# Altium schematic sheet RES-001 AutoHAT V2 SD Adapter Sub-Board - Top.SchDoc: Top
size A3; CheckedBy: K Riegel; DrawnBy: K Riegel; DocumentNumber: 1; SheetNumber: 1; SheetTotal: 1
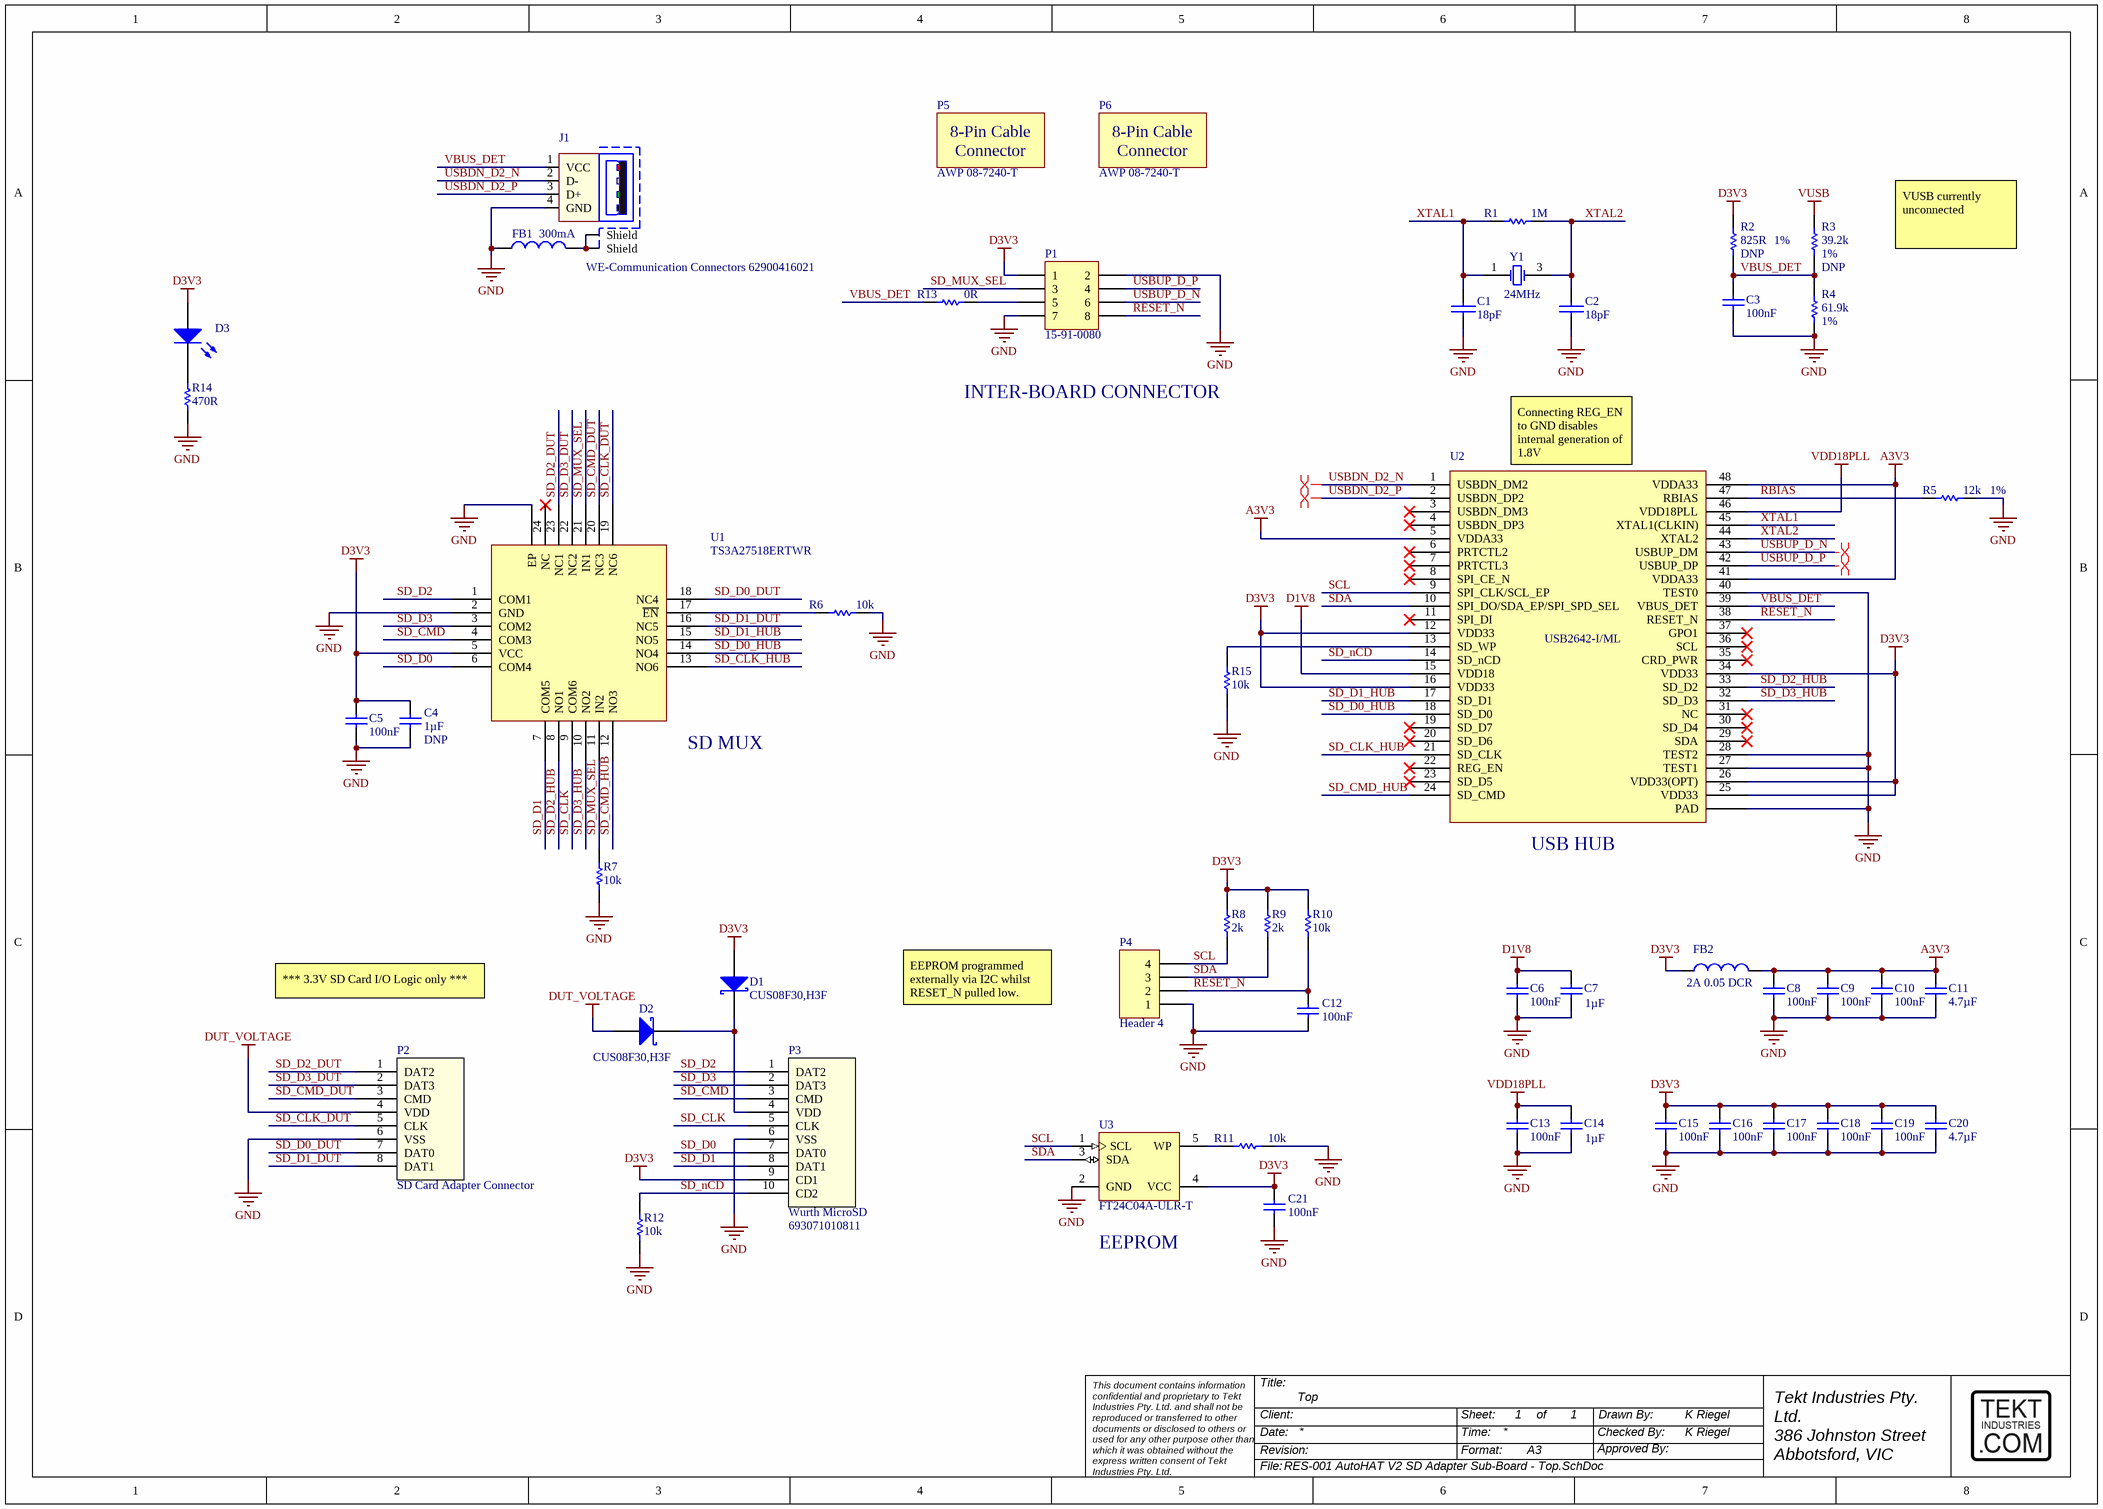
[diagram p0: RES-001 AutoHAT V2 SD Adapter Sub-Board - Top.SchDoc]

## Parts
C1  18pF  [0603C - HD]
C2  18pF  [0603C - HD]
C3  100nF  [0402]
C4  Load: DNP  [0603C - HD]  (hidden comment: 1µF)
C5  100nF  [0402]
C6  100nF  [0402]
C7  1µF  [0603C - HD]
C8  100nF  [0402]
C9  100nF  [0402]
C10  100nF  [0402]
C11  4.7µF  [0603C - HD]
C12  100nF  [0402]
C13  100nF  [0402]
C14  1µF  [0603C - HD]
C15  100nF  [0402]
C16  100nF  [0402]
C17  100nF  [0402]
C18  100nF  [0402]
C19  100nF  [0402]
C20  4.7µF  [0603C - HD]
C21  100nF  [0402]
D1  CUS08F30,H3F  [USC]
D2  CUS08F30,H3F  [USC]
D3  (no value)  [0603LED - HD]
FB1  300mA  [0603L - HD]
FB2  2A 0.05 DCR  [0603L - HD]
J1  WE-Communication Connectors 62900416021  [62900416021]
P1  15-91-0080  [15-91-0080]
P2  SD Card Adapter Connector  [SD Card]  (no BOM)
P3  Wurth MicroSD  [693071010811]
P4  Header 4  [HDR1X4]  (no BOM)
P5  AWP 08-7240-T  (mechanical)
P6  AWP 08-7240-T  (mechanical)
R1  1M  [0603R - HD]
R2  Load: DNP  Precision: 1%  [0603R - HD]  (hidden comment: 825R)
R3  Load: DNP  Precision: 1%  [0603R - HD]  (hidden comment: 39.2k)
R4  Precision: 1%  [0603R - HD]  (hidden comment: 61.9k)
R5  Precision: 1%  [0603R - HD]  (hidden comment: 12k)
R6  10k  [0603R - HD]
R7  10k  [0603R - HD]
R8  2k  [0603R - HD]
R9  2k  [0603R - HD]
R10  10k  [0603R - HD]
R11  10k  [0603R - HD]
R12  10k  [0603R - HD]
R13  0R  [0603R - HD]
R14  470R  [0603R - HD]
R15  10k  [1608[0603]]
U1  TS3A27518ERTWR  [QFN-24]
U2  USB2642-I/ML  [QFN48]
U3  FT24C04A-ULR-T  [SOT-23-5]
Y1  24MHz  [XTAL - 2 x 1.6]

## Nets
A3V3: C8.2 C9.2 C10.2 C11.2 FB2.2 U2.5(VDDA33) U2.41(VDDA33) U2.48(VDDA33)
D1V8: C6.2 C7.2 U2.15(VDD18)
D3V3: C4.2 C5.2 C15.2 C16.2 C17.2 C18.2 C19.2 C20.2 C21.2 D1.1(A) D3.1(A) FB2.1 P1.1 P3.9(CD1) R2.1 R8.2 R9.2 R10.1 U1.5(VCC) U2.12(VDD33) U2.16(VDD33) U2.25(VDD33) U2.26(VDD33(OPT)) U2.34(VDD33) U3.4(VCC)
DUT_VOLTAGE: D2.1(A) P2.4(VDD)
GND: C1.2 C2.2 C3.1 C4.1 C5.1 C6.1 C7.1 C8.1 C9.1 C10.1 C11.1 C12.1 C13.1 C14.1 C15.1 C16.1 C17.1 C18.1 C19.1 C20.1 C21.1 FB1.1 J1.4(GND) P1.2 P1.7 P2.6(VSS) P3.6(VSS) P4.1 R4.2 R5.1 R6.2 R7.1 R11.1 R12.1 R14.2 R15.2 U1.0(EP) U1.2(GND) U2.27(TEST1) U2.28(TEST2) U2.40(TEST0) U2.PAD U3.2(GND)
VDD18PLL: C13.2 C14.2 U2.46(VDD18PLL)
VUSB: R3.1
RBIAS: R5.2 U2.47(RBIAS)
RESET_N: C12.2 P1.8 P4.2 R10.2 U2.38(RESET_N)
SCL: P4.4 R8.1 U2.9(SPI_CLK/SCL_EP) U3.1(SCL)
SD_CLK: P3.5(CLK) U1.9(COM6)
SD_CLK_DUT: P2.5(CLK) U1.19(NC6)
SD_CLK_HUB: U1.13(NO6) U2.21(SD_CLK)
SD_CMD: P3.3(CMD) U1.4(COM3)
SD_CMD_DUT: P2.3(CMD) U1.20(NC3)
SD_CMD_HUB: U1.12(NO3) U2.24(SD_CMD)
SD_D0: P3.7(DAT0) U1.6(COM4)
SD_D0_DUT: P2.7(DAT0) U1.18(NC4)
SD_D0_HUB: U1.14(NO4) U2.18(SD_D0)
SD_D1: P3.8(DAT1) U1.7(COM5)
SD_D1_DUT: P2.8(DAT1) U1.16(NC5)
SD_D1_HUB: U1.15(NO5) U2.17(SD_D1)
SD_D2: P3.1(DAT2) U1.1(COM1)
SD_D2_DUT: P2.1(DAT2) U1.23(NC1)
SD_D2_HUB: U1.8(NO1) U2.33(SD_D2)
SD_D3: P3.2(DAT3) U1.3(COM2)
SD_D3_DUT: P2.2(DAT3) U1.22(NC2)
SD_D3_HUB: U1.10(NO2) U2.32(SD_D3)
SD_MUX_SEL: P1.3 R7.2 U1.11(IN2) U1.21(IN1)
SD_nCD: P3.10(CD2) R12.2 U2.14(SD_nCD)
SDA: P4.3 R9.1 U2.10(SPI_DO/SDA_EP/SPI_SPD_SEL) U3.3(SDA)
USBDN_D2_N: J1.2(D-) U2.1(USBDN_DM2)
USBDN_D2_P: J1.3(D+) U2.2(USBDN_DP2)
USBUP_D_N: P1.6 U2.43(USBUP_DM)
USBUP_D_P: P1.4 U2.42(USBUP_DP)
VBUS_DET: C3.2 J1.1(VCC) R2.2 R3.2 R4.1 R13.1 U2.39(VBUS_DET)
XTAL1: C1.1 R1.1 U2.45(XTAL1(CLKIN)) Y1.1(OSC1)
XTAL2: C2.1 R1.2 U2.44(XTAL2) Y1.3(OSC2)
NetD1_2: D1.2(K) D2.2(K) P3.4(VDD)
NetD3_2: D3.2(K) R14.1
NetFB1_2: FB1.2 J1.Z1(Shield) J1.Z2(Shield)
NetP1_5: P1.5 R13.2
NetR6_1: R6.1 U1.17(~{EN})
NetR11_2: R11.2 U3.5(WP)
NetR15_1: R15.1 U2.13(SD_WP)

Not connected (* = marked no-connect by the designer): U1 24(NC)*; U2 3(USBDN_DM3)* 4(USBDN_DP3)* 6(PRTCTL2)* 7(PRTCTL3)* 8(SPI_CE_N)* 11(SPI_DI)* 19(SD_D7)* 20(SD_D6)* 22(REG_EN)* 23(SD_D5)* 29(SDA)* 30(SD_D4)* 31(NC)* 35(CRD_PWR)* 36(SCL)* 37(GPO1)*

## Layout directives
differential pair: USBDN_D2_N, USBDN_D2_P, USBUP_D_N, USBUP_D_P

## Notes on the sheet
- VUSB currently unconnected
- INTER-BOARD CONNECTOR
- (near U2) Connecting REG_EN to GND disables internal generation of 1.8V
- (near U1) SD MUX
- (near U2) USB HUB
- *** 3.3V SD Card I/O Logic only ***
- EEPROM programmed externally via I2C whilst RESET_N pulled low.
- (near U3) EEPROM
- Title:
- Date:
- Revision:
- Client:
- Sheet:
- Time:
- Format:
- A3
- of
- Checked By:
- Approved By:
- Drawn By:
- Tekt Industries Pty. Ltd.
  386 Johnston Street
  Abbotsford, VIC
  Australia, 3067
- This document contains information confidential and proprietary to Tekt Industries Pty. Ltd. and shall not be reproduced or transferred to other documents or disclosed to others or used for any other purpose other than which it was obtained without the express written consent of Tekt Industries Pty. Ltd.
- File:
- (in symbol AWP 08-7240-T) 8-Pin Cable Connector

## Library data of the parts
C1 C2 = WARDIND3.S01_1uF_14: 18pF ±5% 100V Ceramic Capacitor C0G, NP0 0603 (1608 Metric); Manufacturer: Samsung Electro-Mechanics America, Inc; Manufacturer Part No.: CL10C180JC8NNNC; Cost_1000: 0.01353; Cost_100: 0.02460; Load: YES; Cost_1: 0.10000; Value: 18pF; Supplier Part No.: 1276-2210-1-ND; Rating: 100V; Supplier: Digi-Key; Mount: SMT; Package: 0603; Checked: YES; Checked_Date: 2017.06.26
C3 C5 C6 C8-C10 C12 C13 C15-C19 C21 = Cap: 0.10µF 16V Ceramic Capacitor X7R 0402 (1005 Metric) 0.039" L x 0.020" W (1.00mm x 0.50mm); Manufacturer: Samsung Electro-Mechanics America, Inc; Manufacturer Part No.: CL05B104KO5NNNC; Cost_1: 0.10000; Cost_100: 0.00500; Load: YES; Cost_1000: 0.00308; Value: 100nF; Mount: SMT; Rating: 16V; Supplier: Digi-Key; Supplier Part No.: 1276-1001-1-ND; Package: 0402; Checked: YES; Checked_Date: 2017.06.26
C4 = Cap: 1µF 10V Ceramic Capacitor X7R 0603 (1608 Metric) 0.063" L x 0.031" W (1.60mm x 0.80mm); Manufacturer: Samsung Electro-Mechanics America, Inc; Manufacturer Part No.: CL10B105KP8NNNC; Cost_1: 0.10000; Cost_100: 0.01870; Cost_1000: 0.01070; Checked: YES; Value: 1µF; Mount: SMT; Rating: 10V; Supplier: Digi-Key; Supplier Part No.: 1276-1946-1-ND; Package: 0603; Checked_Date: 2017.06.26
C7 C14 = Cap: 1µF 10V Ceramic Capacitor X7R 0603 (1608 Metric) 0.063" L x 0.031" W (1.60mm x 0.80mm); Manufacturer: Samsung Electro-Mechanics America, Inc; Manufacturer Part No.: CL10B105KP8NNNC; Cost_1: 0.10000; Cost_100: 0.01870; Load: YES; Cost_1000: 0.01070; Value: 1µF; Mount: SMT; Rating: 10V; Supplier: Digi-Key; Supplier Part No.: 1276-1946-1-ND; Package: 0603; Checked: YES; Checked_Date: 2017.06.26
C11 C20 = Cap: 4.7µF 10V Ceramic Capacitor X5R 0603 (1608 Metric) 0.063" L x 0.031" W (1.60mm x 0.80mm); Manufacturer: Samsung Electro-Mechanics America, Inc; Manufacturer Part No.: CL10A475KP8NNNC; Cost_1: 0.12000; Cost_100: 0.04320; Load: YES; Cost_1000: 0.02756; Value: 4.7µF; Mount: SMT; Rating: 10V; Supplier: Digi-Key; Supplier Part No.: 1276-1044-1-ND; Package: 0603; Checked: YES; Checked_Date: 2017.06.26
D1 D2 = D Schottky: Schottky Diode; Manufacturer: Toshiba Semiconductor and Storage; Cost_1: 0.37000; Cost_100: 0.18900; Rating: 800mA; Load: YES; Manufacturer Part No.: CUS08F30,H3F; Mount: SMT; Supplier: Digi-Key; Supplier Part No.: CUS08F30H3FCT-ND
D3 = LED1: Green 571nm LED Indication - Discrete 2V 0603 (1608 Metric); Manufacturer: Lite-On Inc.; Manufacturer Part No.: LTST-C190KGKT; Cost_1: 0.28000; Cost_100: 0.10750; Rating: 25mA DC; Value: Green LED; Load: YES; Cost_1000: 0.05054; Mount: SMT; Supplier: Digi-Key; Supplier Part No.: 160-1435-1-ND; Package: 0603; Checked: YES; Checked_Date: 2017.06.23
FB1 = Inductor: 470 Ohm 1 Ferrite Bead 0603 (1608 Metric) 300mA 350 mOhm Max DCR; Manufacturer: Samsung Electro-Mechanics America, Inc; Manufacturer Part No.: CIM10J471NC; Cost_1: 0.10000; Cost_100: 0.02940; Load: YES; Cost_1000: 0.01108; Value: 300mA; Mount: SMT; Rating: 300mA; Supplier: Digi-Key; Supplier Part No.: 1276-6380-1-ND; Package: 0603; Checked: YES; Checked_Date: 2017.06.26
FB2 = Inductor: Manufacturer: TDK Corporation; Manufacturer Part No.: MPZ1608S181ATAH0; Cost_1: 0.10000; Cost_100: 0.04720; Load: YES; Cost_1000: 0.02826; Value: 2A 0.05 DCR; Mount: SMT; Rating: 2A 0.05 DCR; Supplier: Digi-Key; Supplier Part No.: 445-5220-1-ND; Package: 0603; Checked: YES; Checked_Date: 2017.06.26
J1 = WE-Communication Connectors 62900416021: WR-COM USB SMT Type A; Manufacturer: W¨¹rth Elektronik eiSos GmbH; Cost_1: 2.63000; Cost_100: 2.21330; Load: YES; Cost_1000: 1.84503; Manufacturer Part No.: 62900416021; Mount: SMT; Supplier: Digi-Key; Supplier Part No.: 732-3181-ND; Checked: YES; Checked_Date: 2017.06.26
P1 = Header 4X2: Header, 4-Pin, Dual row; Manufacturer: Molex, LLC; Cost_1: 0.77000; Cost_100: 0.58500; Cost_1000: 0.42548; Load: YES; Manufacturer Part No.: 15-91-0080; Mount: SMT; Supplier: Digi-Key; Supplier Part No.: WM17458-ND
P3 = Molex MicroSD: Value: 693071010811; Load: YES; Manufacturer: Wurth; Manufacturer Part No.: 693071010811; Mount: SMT; Supplier: Wurth; Supplier Part No.: 693071010811; Checked: YES; Checked_Date: 2017.06.26
P4 = Header 4: Header, 4-Pin
P5 P6 = AWP 08-7240-T: 8 Position Rectangular Socket Connector IDC Gold; Manufacturer: Assmann WSW Components; Cost_1: 0.96000; Cost_100: 0.72790; Cost_1000: 0.52940; Load: YES; Manufacturer Part No.: AWP 08-7240-T; Supplier: Digi-Key; Supplier Part No.: AE11246-ND
R1 = Res1: RES SMD 1M OHM 5% 1/10W 0603; Manufacturer: Samsung Electro-Mechanics America, Inc; Manufacturer Part No.: RC1608J105CS; Cost_1: 0.10000; Cost_100: 0.00600; Rating: 0.1W; Load: YES; Cost_1000: 0.00391; Value: 1M; Mount: SMT; Supplier: Digi-Key; Supplier Part No.: 1276-5134-1-ND; Package: 0603; Checked: YES; Checked_Date: 2017.06.26
R2 = Res1: 825 Ohm ±1% 0.1W, 1/10W Chip Resistor 0603 (1608 Metric) Moisture Resistant Thick Film; Manufacturer: Yageo; Manufacturer Part No.: RC0603FR-07825RL; Cost_1: 0.11000; Cost_100: 0.00670; Rating: 1% 0.1W; Cost_1000: 0.00298; Checked: YES; Value: 825R; Mount: SMT; Supplier: Digi-Key; Supplier Part No.: 311-825HRCT-ND; Package: 0603; Checked_Date: 2017.06.26
R3 = Res1: 39.2k Ohm ±1% 0.1W, 1/10W Chip Resistor 0603 (1608 Metric) Moisture Resistant Thick Film; Manufacturer: Yageo; Manufacturer Part No.: RC0603FR-0739K2L; Cost_1: 0.11000; Cost_100: 0.00670; Rating: 1% 0.1W; Cost_1000: 0.00298; Checked: YES; Value: 39.2k; Mount: SMT; Supplier: Digi-Key; Supplier Part No.: 311-39.2KHRCT-ND; Package: 0603; Checked_Date: 2017.06.26
R4 = Res1: 39.2k Ohm ±1% 0.1W, 1/10W Chip Resistor 0603 (1608 Metric) Moisture Resistant Thick Film; Manufacturer: Yageo; Manufacturer Part No.: RC0603FR-0761K9L; Cost_1: 0.11000; Cost_100: 0.00670; Rating: 1% 0.1W; Load: YES; Cost_1000: 0.00298; Value: 61.9k; Mount: SMT; Supplier: Digi-Key; Supplier Part No.: 311-61.9KHRCT-ND; Package: 0603; Checked: YES; Checked_Date: 2017.06.26
R5 = Res1: 12k Ohm ±1% 0.1W, 1/10W Chip Resistor 0603 (1608 Metric) Moisture Resistant Thick Film; Manufacturer: Yageo; Manufacturer Part No.: RC0603FR-0712KL; Cost_1: 0.11000; Cost_100: 0.00670; Rating: 1% 0.1W; Load: YES; Cost_1000: 0.00298; Value: 12k; Mount: SMT; Supplier: Digi-Key; Supplier Part No.: 311-12.0KHRTR-ND; Package: 0603; Checked: YES; Checked_Date: 2017.06.22
R6 R7 R10-R12 R15 = Res1: RES SMD 10K OHM 5% 1/10W 0603; Manufacturer: Samsung Electro-Mechanics America, Inc; Manufacturer Part No.: RC1608J103CS; Cost_1: 0.13000; Cost_100: 0.01210; Rating: 0.1W; Load: YES; Cost_1000: 0.00391; Value: 10k; Mount: SMT; Supplier: Digi-Key; Supplier Part No.: 1276-5086-1-ND; Package: 0603; Checked: YES; Checked_Date: 2017.06.26
R8 R9 = Res1: RES SMD 2K OHM 5% 1/10W 0603; Manufacturer: Yageo; Manufacturer Part No.: RC0603JR-072KL; Cost_1: 0.10000; Cost_100: 0.00420; Rating: 0.1W; Load: YES; Value: 2k; Mount: SMT; Supplier: Digi-Key; Supplier Part No.: 311-2.0KGRCT-ND; Package: 0603; Checked: YES; Checked_Date: 2017.06.26
R13 = Res1: RES SMD 0 OHM JUMPER; Manufacturer: Samsung Electro-Mechanics America, Inc; Manufacturer Part No.: RC1608J000CS; Cost_1: 0.10000; Cost_100: 0.00440; Load: YES; Rating: 0.1W; Cost_1000: 0.00322; Value: 0R; Mount: SMT; Supplier: Digi-Key; Supplier Part No.: 1276-3510-1-ND; Package: 0603; Checked: YES; Checked_Date: 2017.06.23
R14 = Res1: RES SMD 470 OHM 5% 1/10W 0603; Manufacturer: Samsung Electro-Mechanics America, Inc; Manufacturer Part No.: RC1608J471CS; Cost_1: 0.10000; Cost_100: 0.00460; Load: YES; Rating: 0.1W; Cost_1000: 0.00391; Value: 470R; Mount: SMT; Supplier: Digi-Key; Supplier Part No.: 1276-5054-1-ND; Checked: YES; Checked_Date: 2017.06.23; Package: 0603
U1 = TS3A27518E: IC MUX/DEMUX 6X1 24WQFN; Manufacturer: Texas Instruments; Cost_1: 2.56000; Cost_100: 1.84820; Cost_1000: 1.25813; Load: YES; Manufacturer Part No.: TS3A27518ERTWR; Mount: SMT; Package: 24-WQFN; Supplier: Digi-Key; Supplier Part No.: 296-25415-1-ND
U2 = USB2642: IC FLASH MEDIA CTLR USB2 48VQFN; Manufacturer: Microchip Technology; Cost_1: 5.09000; Cost_100: 4.09740; Load: YES; Manufacturer Part No.: USB2642-I/ML; Mount: SMT; Package: 48-QFN; Supplier: Digi-Key; Supplier Part No.: USB2642-I/ML-ND; Checked: YES; Checked_Date: 2017.06.26
U3 = FT24C04A-ULR-T: EEPROM Memory IC 4Kb (512 x 8) I²C 550ns SOT-23-5; Manufacturer: Fremont Micro Devices USA; Load: YES; Cost_1: 0.48000; Cost_100: 0.30500; Cost_1000: 0.18184; Manufacturer Part No.: FT24C04A-ULR-T; Mount: SMT; Supplier: Digi-Key; Supplier Part No.: 1219-1066-1-ND; Package: SOT-23-5; Checked: YES; Checked_Date: 2017.06.26
Y1 = XTAL: 24MHz ±20ppm Crystal 6pF 150 Ohm -30°C ~ 85°C Surface Mount 4-SMD, No Lead; Manufacturer: Murata Electronics North America; Manufacturer Part No.: XRCGB24M000F2P00R0; Cost_1: 0.42000; Cost_100: 0.27800; Load: YES; Cost_1000: 0.22239; Mount: SMT; Supplier: Digi-Key; Supplier Part No.: 490-9762-1-ND; Value: 24MHz; Checked: YES; Checked_Date: 2017.06.26